# EAGLE board r3eflow-v3 (EAGLE 9.3.2)
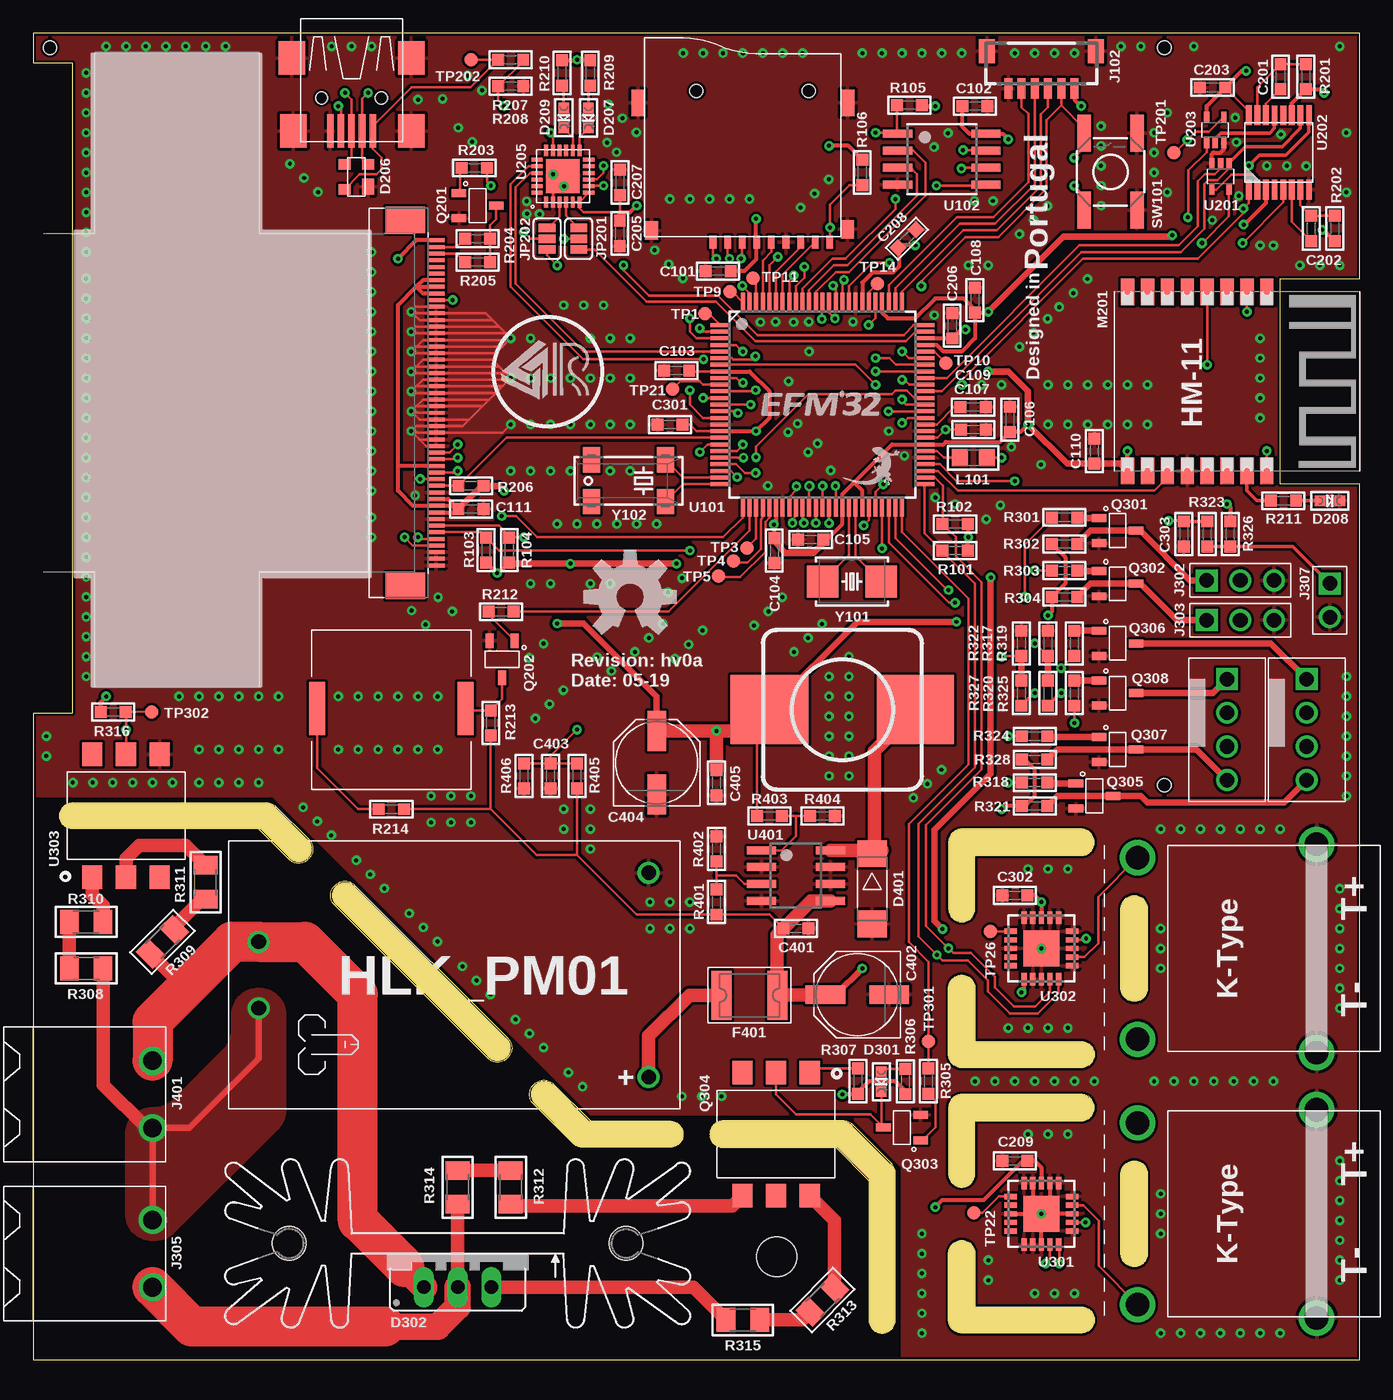
[diagram p4: board, top side]
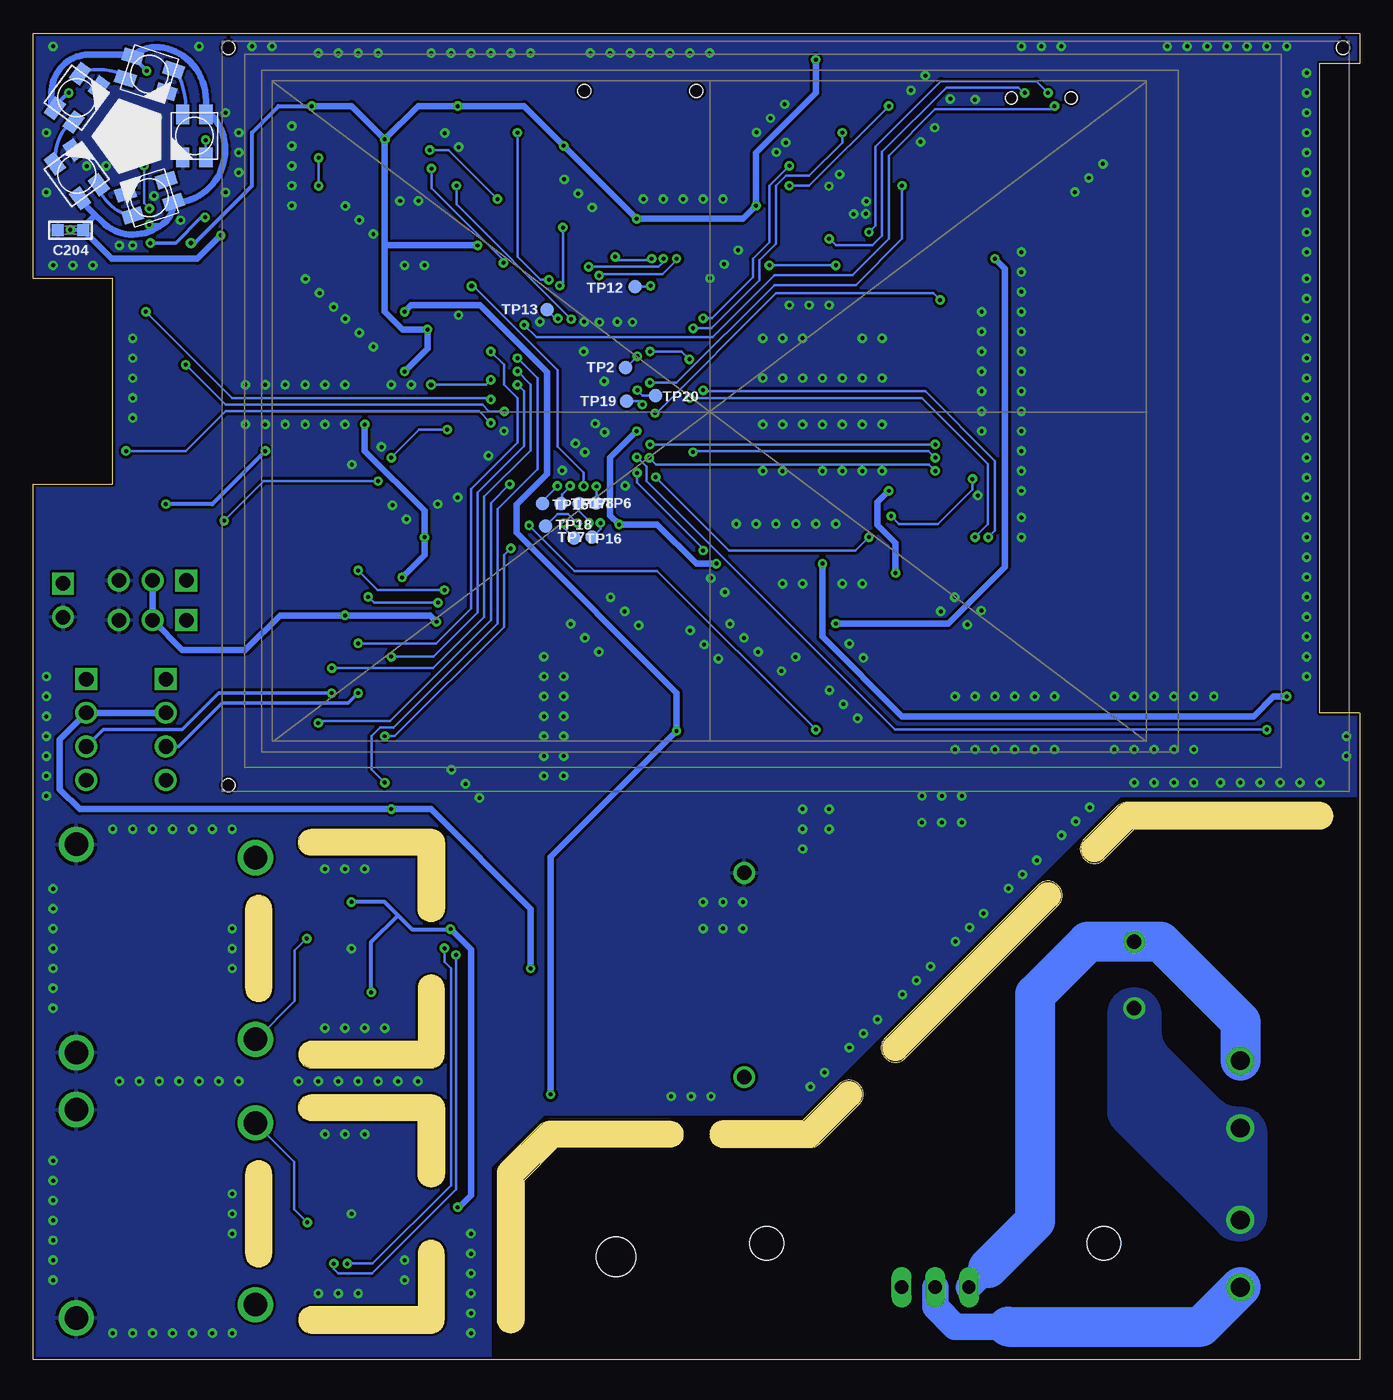
[diagram p5: board, bottom side, seen from below]

Size 100 x 100 mm. Coordinates in mm from the lower left corner, seen from the top.
Outline: 0,0 100,0 100,66 94,66 94,81.5 100,81.5 100,100 0,100 0,97.75 3,97.75 3,48.75 0,48.75 0,0
Outline: 69,23 69,28 arc-90 70,29 arc-90 71,28 71,24 79,24 arc-90 80,23 arc-90 79,22 70,22 arc-90 69,23
Outline: 71,18 79,18 arc90 80,19 arc90 79,20 70,20 arc90 69,19 69,14 arc90 70,13 arc90 71,14 71,18
Outline: 71,4 79,4 arc-90 80,3 arc-90 79,2 70,2 arc-90 69,3 69,8 arc-90 70,9 arc-90 71,8 71,4
Outline: 84,14 84,8 arc-90 83,7 arc-90 82,8 82,14 arc-90 83,15 arc-90 84,14
Outline: 82,28 82,34 arc-90 83,35 arc-90 84,34 84,28 arc-90 83,27 arc-90 82,28
Outline: 79,40 70,40 arc90 69,39 69,34 arc90 70,33 arc90 71,34 71,38 79,38 arc90 80,39 arc90 79,40
Outline: 2,41 arc-90 3,42 17.59,42 arc-45 18.29,41.71 20.79,39.21 arc-90 20.79,37.79 20.71,37.71 arc-90 19.29,37.71 17,40 3,40 arc-90 2,41
Outline: 42,18 48,18 arc-90 49,17 arc-90 48,16 41.41,16 arc-45 40.71,16.29 37.71,19.29 arc-90 37.71,20.71 37.79,20.79 arc-90 39.21,20.79 42,18
Outline: 35.79,22.79 35.71,22.71 arc-90 34.29,22.71 22.71,34.29 arc-90 22.71,35.71 22.79,35.79 arc-90 24.21,35.79 35.79,24.21 arc-90 35.79,22.79
Outline: 61.09,18 52,18 arc90 51,17 arc90 52,16 60.5,16 63,13.5 63,3 arc90 64,2 arc90 65,3 65,14.09 arc45 64.71,14.79 61.79,17.71 arc45 61.09,18
Copper layers (1*16): Top 0.035mm / dielectric 1.5mm / Bottom 0.035mm
Design rules "default *": minimum track width 5mil, minimum drill 0.3mm, track to track 5mil, track to pad 5mil, pad to pad 5mil, via to via 5mil, smd to smd 5mil, copper to edge 0.2mm, drill to drill 5mil, minimum pad ring 10mil, minimum via ring 8mil, stop-mask expansion 4mil, vias tented up to drill 0.7mm, thermal gap 10mil
Holes 3 mm at 56.05,7.75
tRestrict: area 53.1,4.7 to 59.1,10.7
bRestrict: area 53.1,4.7 to 59.1,10.7
Milling: 18 lines

## Footprints (pad centres in the part's own frame; a part is rotated, then mirrored left to right if it is on the bottom)
HLK-PM01 = drill 1.1: +VO 29.4,-7.7; -VO 29.4,7.7; AC1 0,2.5; AC2 0,-2.5
BUZZ_PIEZO_SMD = smd 1.2 x 4: 1 -5.6,0.1; 2 5.6,0.1
0603_WAVE = smd 0.9 x 0.9: P$1 -0.95,0; P$2 0.95,0
PANASONIC_D = smd 3 x 1.4: + 2.4,0; - -2.4,0
3535 = smd 1 x 1.5: 1 -0.875,-1.619; 2 0.875,-1.619; 3 0.875,1.619; 4 -0.875,1.619
SOT143 = smd 1.2 x 0.9: 1 -0.711,-0.889 | smd 0.8 x 0.9: 2 0.989,-0.889; 3 0.989,0.911; 4 -0.911,0.911
CHIPLED_0603 = smd 0.8 x 0.8: A 0,-0.75; C 0,0.75
TO220DS = drill 1.016 long: A1 -2.54,-2.54; A2 0,-2.54; G 2.54,-2.54
DO214AA = smd 2 x 2.2: A 2.65,0; C -2.65,0
PTC1812 = smd 1.5 x 3.7: P$1 -2.1,0; P$2 2.1,0
MICRO-SD = smd 0.5 x 1: 1 2.25,6.75; 2 1.15,6.75; 3 0.05,6.75; 4 -1.05,6.75; 5 -2.15,6.75; 6 -3.25,6.75; 7 -4.35,6.75; 8 -5.45,6.75; 9 -6.55,6.75 | smd 1 x 1.4: BODY1 -7.89,5.78; BODY4 6.89,5.88 | smd 1 x 2: BODY2 -7.9,-3.75; BODY3 7.9,-3.75 | hole 1: -4.95,-4.65; 3.5,-4.65
SM06B-SSR-H-TB = smd 0.6 x 1.55: 1 -2.5,1.925; 2 -1.5,1.925; 3 -0.5,1.925; 4 0.5,1.925; 5 1.5,1.925; 6 2.5,1.925 | smd 1.2 x 1.8: FIT@1 -4.1,-0.9; FIT@2 4.1,-0.9
USB-M-S1 = smd 2.5 x 0.5: D+ 2.75,0; D- 2.75,0.8; GND 2.75,-1.6; ID 2.75,-0.8; VBUS 2.75,1.6 | smd 2.5 x 2: GND@1 -2.75,-4.5; GND@2 -2.75,4.5; GND@3 2.75,-4.4; GND@4 2.75,4.5 | hole 0.9: 0.25,2.25; 0.25,-2.25
PCC-SMP = drill 1.77: 1-T+ -6.85,-6.75; 2-T- 6.85,-6.75; 3-BAR 7.85,6.75; 4-BAR -7.85,6.75
3X1_2.54 = drill 1.1 square: P$1 -2.54,0 | drill 1.1: P$2 0,0; P$3 2.54,0
2EDG-2P = drill 1.4: P$1 -2.54,0; P$2 2.54,0
KF2510-3+1P = drill 1.1 square: 1 -3.81,0 | drill 1.1: 2 -1.27,0; 3 1.27,0; 4 3.81,0
2X1_2.54 = drill 1.1 square: 1 -1.27,0 | drill 1.1: 2 1.27,0
SMT-JUMPER_3_1-NC_PASTE_SILK = smd 0.635 x 1.27: 1 -0.813,0; 2 0,0; 3 0.813,0
SK104 = hole 2.54: -12.7,-0.762; 12.7,-0.762
_0805 = smd 1.2 x 1.3: 1 -1.016,0; 2 1.016,0
1207 = smd 5.8 x 5.2: 1 -5.5,0 | smd 5.9 x 5.2: 2 5.5,0
HM-11 = smd 2 x 1: 1 0,10.5; 2 0,9; 3 0,7.5; 4 0,6; 5 0,4.5; 6 0,3; 7 0,1.5; 8 0,0; 9 13.5,0; 10 13.5,1.5; 11 13.5,3; 12 13.5,4.5; 13 13.5,6; 14 13.5,7.5; 15 13.5,9; 16 13.5,10.5
SOT-23-3 = smd 0.6 x 1.1: P$1 -0.95,-1.4; P$2 0.95,-1.4; P$3 0,1.4
DIP-6-SMD = smd 1.52 x 1.78: P$1 -2.54,-4.635; P$2 0,-4.635; P$3 2.54,-4.635; P$4 2.54,4.635; P$5 0,4.635; P$6 -2.54,4.635
_1206 = smd 1.4 x 1.8: 1 -1.27,0; 2 1.27,0
PUSH_BUTTON = smd 2.8 x 1: 1 -2.9,2; 2 2.9,2; 3 -2.9,-2; 4 2.9,-2
TEST_POINT = smd 1 x 1: 1 0,0
QFP100 = smd 1.45 x 0.3: 1 -7.7,6; 2 -7.7,5.5; 3 -7.7,5; 4 -7.7,4.5; 5 -7.7,4; 6 -7.7,3.5; 7 -7.7,3; 8 -7.7,2.5; 9 -7.7,2; 10 -7.7,1.5; 11 -7.7,1; 12 -7.7,0.5; 13 -7.7,0; 14 -7.7,-0.5; 15 -7.7,-1; 16 -7.7,-1.5; 17 -7.7,-2; 18 -7.7,-2.5; 19 -7.7,-3; 20 -7.7,-3.5; 21 -7.7,-4; 22 -7.7,-4.5; 23 -7.7,-5; 24 -7.7,-5.5; 25 -7.7,-6; 51 7.7,-6; 52 7.7,-5.5; 53 7.7,-5; 54 7.7,-4.5; 55 7.7,-4; 56 7.7,-3.5; 57 7.7,-3; 58 7.7,-2.5; 59 7.7,-2; 60 7.7,-1.5; 61 7.7,-1; 62 7.7,-0.5; 63 7.7,0; 64 7.7,0.5; 65 7.7,1; 66 7.7,1.5; 67 7.7,2; 68 7.7,2.5; 69 7.7,3; 70 7.7,3.5; 71 7.7,4; 72 7.7,4.5; 73 7.7,5; 74 7.7,5.5; 75 7.7,6 | smd 0.3 x 1.45: 26 -6,-7.7; 27 -5.5,-7.7; 28 -5,-7.7; 29 -4.5,-7.7; 30 -4,-7.7; 31 -3.5,-7.7; 32 -3,-7.7; 33 -2.5,-7.7; 34 -2,-7.7; 35 -1.5,-7.7; 36 -1,-7.7; 37 -0.5,-7.7; 38 0,-7.7; 39 0.5,-7.7; 40 1,-7.7; 41 1.5,-7.7; 42 2,-7.7; 43 2.5,-7.7; 44 3,-7.7; 45 3.5,-7.7; 46 4,-7.7; 47 4.5,-7.7; 48 5,-7.7; 49 5.5,-7.7; 50 6,-7.7; 76 6,7.7; 77 5.5,7.7; 78 5,7.7; 79 4.5,7.7; 80 4,7.7; 81 3.5,7.7; 82 3,7.7; 83 2.5,7.7; 84 2,7.7; 85 1.5,7.7; 86 1,7.7; 87 0.5,7.7; 88 0,7.7; 89 -0.5,7.7; 90 -1,7.7; 91 -1.5,7.7; 92 -2,7.7; 93 -2.5,7.7; 94 -3,7.7; 95 -3.5,7.7; 96 -4,7.7; 97 -4.5,7.7; 98 -5,7.7; 99 -5.5,7.7; 100 -6,7.7
WSOIC8 = smd 0.6 x 2.2: 1 -1.905,-3.33; 2 -0.635,-3.33; 3 0.635,-3.33; 4 1.905,-3.33; 5 1.905,3.33; 6 0.635,3.33; 7 -0.635,3.33; 8 -1.905,3.33
SC-70-5 = smd 0.4 x 0.75: 1 -0.65,-1; 2 0,-1; 3 0.65,-1; 4 0.65,1; 5 -0.65,1
TSSOP-16 = smd 0.45 x 1.5: 1 -2.275,-2.8; 2 -1.625,-2.8; 3 -0.975,-2.8; 4 -0.325,-2.8; 5 0.325,-2.8; 6 0.975,-2.8; 7 1.625,-2.8; 8 2.275,-2.8; 9 2.275,2.8; 10 1.625,2.8; 11 0.975,2.8; 12 0.325,2.796; 13 -0.325,2.796; 14 -0.975,2.8; 15 -1.625,2.8; 16 -2.275,2.8
ZIF50-TFT_BACK = smd 1.3 x 0.3 bottom: 1 55.369,41.54; 2 55.369,41.04; 3 55.369,40.54; 4 55.369,40.04; 5 55.369,39.54; 6 55.369,39.04; 7 55.369,38.54; 8 55.369,38.04; 9 55.369,37.54; 10 55.369,37.04; 11 55.369,36.54; 12 55.369,36.04; 13 55.369,35.54; 14 55.369,35.04; 15 55.369,34.54; 16 55.369,34.04; 17 55.369,33.54; 18 55.369,33.04; 19 55.369,32.54; 20 55.369,32.04; 21 55.369,31.54; 22 55.369,31.04; 23 55.369,30.54; 24 55.369,30.04; 25 55.369,29.54; 26 55.369,29.04; 27 55.369,28.54; 28 55.369,28.04; 29 55.369,27.54; 30 55.369,27.04; 31 55.369,26.54; 32 55.369,26.04; 33 55.369,25.54; 34 55.369,25.04; 35 55.369,24.54; 36 55.369,24.04; 37 55.369,23.54; 38 55.369,23.04; 39 55.369,22.54; 40 55.369,22.04; 41 55.369,21.54; 42 55.369,21.04; 43 55.369,20.54; 44 55.369,20.04; 45 55.369,19.54; 46 55.369,19.04; 47 55.369,18.54; 48 55.369,18.04; 49 55.369,17.54; 50 55.369,17.04 | smd 3 x 2 bottom: M1 57.694,15.5; M2 57.694,43.08 | hole 1: 0.475,56.065; 0.475,0.475; 84.485,56.065
QFN24 = smd 0.3 x 0.85: 1 -1.25,-1.95; 2 -0.75,-1.95; 3 -0.25,-1.95; 4 0.25,-1.95; 5 0.75,-1.95; 6 1.25,-1.95; 13 1.25,1.95; 14 0.75,1.95; 15 0.25,1.95; 16 -0.25,1.95; 17 -0.75,1.95; 18 -1.25,1.95 | smd 0.85 x 0.3: 7 1.95,-1.25; 8 1.95,-0.75; 9 1.95,-0.25; 10 1.95,0.25; 11 1.95,0.75; 12 1.95,1.25; 19 -1.95,1.25; 20 -1.95,0.75; 21 -1.95,0.25; 22 -1.95,-0.25; 23 -1.95,-0.75; 24 -1.95,-1.25 | smd 2.55 x 2.55: PAD 0,0
TQFN20-5X5 = smd 0.95 x 0.4: 1 -2.325,1.3; 2 -2.325,0.65; 3 -2.325,0; 4 -2.325,-0.65; 5 -2.325,-1.3; 11 2.325,-1.3; 12 2.325,-0.65; 13 2.325,0; 14 2.325,0.65; 15 2.325,1.3 | smd 0.4 x 0.95: 6 -1.3,-2.325; 7 -0.65,-2.325; 8 0,-2.325; 9 0.65,-2.325; 10 1.3,-2.325; 16 1.3,2.325; 17 0.65,2.325; 18 0,2.325; 19 -0.65,2.325; 20 -1.3,2.325 | smd 2.7 x 2.7: EXP 0,0
SOIC8 = smd 0.6 x 2.2: 1 -1.905,-2.6; 2 -0.635,-2.6; 3 0.635,-2.6; 4 1.905,-2.6; 5 1.905,2.6; 6 0.635,2.6; 7 -0.635,2.6; 8 -1.905,2.6
2-SMD-5X3 = smd 2.4 x 2.4: 1 -2.2,0; 2 2.2,0
CM200S = smd 1.3 x 1.9: 1 -2.794,-1.574; 2 2.794,-1.574; 3 2.794,1.574; 4 -2.794,1.574

## Placement (x,y rotation side)
ACDC401  HLK-PM01  [HLK-PM01]  17,29 0 top
B201  [BUZZ_PIEZO_SMD]  27,49 0 top
C101  100n  [0603_WAVE]  51.64,82.07 180 top
C102  100n  [0603_WAVE]  71,94.5 0 top
C103  100n  [0603_WAVE]  48.51,74.57 180 top
C104  100n  [0603_WAVE]  55.87,60.99 270 top
C105  100n  [0603_WAVE]  58.61,61.82 180 top
C106  1u  [0603_WAVE]  73.63,70.88 90 top
C107  4u7  [0603_WAVE]  70.87,70.11 0 top
C108  1u  [0603_WAVE]  71,79.88 90 top
C109  1u  [0603_WAVE]  70.86,71.8 0 top
C110  100n  [0603_WAVE]  80,68.5 90 top
C111  100n  [0603_WAVE]  33,64.12 0 top
C201  100p  [0603_WAVE]  94.03,96.72 90 top
C202  100p  [0603_WAVE]  96.34,85.28 90 top
C203  [0603_WAVE]  88.91,95.91 180 top
C204  [0603_WAVE]  97.19,85.14 180 bottom
C205  [0603_WAVE]  44.22,84.9 270 top
C206  [0603_WAVE]  69.28,77.94 90 top
C207  [0603_WAVE]  44.25,88.75 90 top
C208  [0603_WAVE]  65.88,84.5 45 top
C209  [0603_WAVE]  74,15 180 top
C301  [0603_WAVE]  48,70.5 180 top
C302  [0603_WAVE]  74,35 180 top
C303  [0603_WAVE]  86.75,62.25 270 top
C401  100n  [0603_WAVE]  57.5,32.5 0 top
C402  [PANASONIC_D]  62.12,27.52 180 top
C403  [0603_WAVE]  39,44 270 top
C404  100u  [PANASONIC_D]  47,45 90 top
C405  100n  [0603_WAVE]  51.5,43.5 270 top
D201  WS2812B  [3535]  87.85,92.25 0 bottom
D202  WS2812B  [3535]  91.23,96.91 72 bottom
D203  WS2812B  [3535]  96.71,95.13 144 bottom
D204  WS2812B  [3535]  96.71,89.37 216 bottom
D205  WS2812B  [3535]  91.23,87.59 288 bottom
D206  SP0503BAHT  [SOT143]  24.38,89.12 90 top
D207  LED0603  [CHIPLED_0603]  41.86,93.61 180 top
D208  LED0603  [CHIPLED_0603]  97.75,64.75 270 top
D209  LED0603  [CHIPLED_0603]  40,93.62 180 top
D301  LED0603  [CHIPLED_0603]  63.94,20.96 180 top
D302  BTA16  [TO220DS]  32,8 0 top
D401  SK54L  [DO214AA]  63.25,35.5 270 top
F401  1A  [PTC1812]  54,27.48 180 top
J101  MICROSD  [MICRO-SD]  53.5,91 180 top
J102  SH-6  [SM06B-SSR-H-TB]  76,97.75 180 top
J201  USB-SHIELD  [USB-M-S1]  24,95.38 270 top
J301  PCC-SMP  [PCC-SMP]  90,11 270 top
J302  3X1_2.54  [3X1_2.54]  91,58.75 0 top
J303  3X1_2.54  [3X1_2.54]  91,55.75 0 top
J304  PCC-SMP  [PCC-SMP]  90,31 270 top
J305  2EDG-2P  [2EDG-2P]  9,8 270 top
J306  4P-PC-FAN  [KF2510-3+1P]  96,47.5 270 top
J307  2X1_2.54  [2X1_2.54]  97.75,57.25 270 top
J308  4P-PC-FAN  [KF2510-3+1P]  90,47.5 270 top
J401  2EDG-2P  [2EDG-2P]  9,20 270 top
JP201  JUMPER-SMT_3_1-NC_PASTE_SILK  [SMT-JUMPER_3_1-NC_PASTE_SILK]  41.13,84.5 90 top
JP202  JUMPER-SMT_3_1-NC_PASTE_SILK  [SMT-JUMPER_3_1-NC_PASTE_SILK]  38.75,84.5 90 top
KK301  SK104  [SK104]  32,8 180 top
L101  4.7nH  [_0805]  70.87,68 180 top
L401  68uH  [1207]  61,49 180 top
LOGO101  DESIGNEDINPT  [DESIGNEDINPT]  76.5,81.5 90 top
LOGO102  RAFAEL_SILVA  [RAFAEL_SILVA_5MM_ALT_3]  36.05,74.38 0 top
LOGO103  OSHW-LOGOL  [OSHW-LOGO-L]  45,57.5 0 top
M201  HM-11  [HM-11]  82.5,80.5 270 top
Q201  BC817-40  [SOT-23-3]  33.5,87 270 top
Q202  BC817-40  [SOT-23-3]  35.35,52.81 180 top
Q301  BC817-40  [SOT-23-3]  81.75,62.5 270 top
Q302  BC817-40  [SOT-23-3]  81.75,58.5 270 top
Q303  BC817-40  [SOT-23-3]  65.5,17.5 90 top
Q304  MOC3051  [DIP-6-SMD]  56,17 180 top
Q305  BC817-40  [SOT-23-3]  80,42.5 270 top
Q306  BC817-40  [SOT-23-3]  81.75,54 270 top
Q307  BC817-40  [SOT-23-3]  81.75,46 270 top
Q308  BC817-40  [SOT-23-3]  81.75,50.25 270 top
R101  [0603_WAVE]  69.5,61 0 top
R102  [0603_WAVE]  69.5,63 0 top
R103  [0603_WAVE]  34.14,61.03 270 top
R104  [0603_WAVE]  35.89,61.03 270 top
R105  [0603_WAVE]  66.05,94.56 0 top
R106  [0603_WAVE]  62.5,89.5 90 top
R201  3k95  [0603_WAVE]  95.94,96.72 90 top
R202  3k95  [0603_WAVE]  98.12,85.28 90 top
R203  [0603_WAVE]  33.26,89.84 180 top
R204  [0603_WAVE]  33.5,84.5 180 top
R205  [0603_WAVE]  33.5,82.75 180 top
R206  [0603_WAVE]  33,65.88 0 top
R207  22.1k  [0603_WAVE]  36,98 180 top
R208  47.5k  [0603_WAVE]  36,96 180 top
R209  [0603_WAVE]  42,97 270 top
R210  [0603_WAVE]  39.88,97 270 top
R211  [0603_WAVE]  94.25,64.75 0 top
R212  [0603_WAVE]  35.27,56.38 180 top
R213  [0603_WAVE]  34.5,48 270 top
R214  [0603_WAVE]  27,41.5 0 top
R301  [0603_WAVE]  77.75,63.5 0 top
R302  [0603_WAVE]  77.75,61.5 180 top
R303  [0603_WAVE]  77.75,59.5 0 top
R304  [0603_WAVE]  77.75,57.5 180 top
R305  [0603_WAVE]  67.5,21 270 top
R306  [0603_WAVE]  65.74,20.97 90 top
R307  [0603_WAVE]  62.16,21 270 top
R308  54.9k  [_1206]  4,29.5 180 top
R309  54.9k  [_1206]  9.75,31.5 45 top
R310  54.9k  [_1206]  4,33 0 top
R311  54.9k  [_1206]  13,36 90 top
R312  [_1206]  36,13 90 top
R313  [_1206]  59.5,4.5 225 top
R314  [_1206]  32,13 270 top
R315  [_1206]  53.5,3 180 top
R316  10k  [0603_WAVE]  6.03,48.82 180 top
R317  [0603_WAVE]  76.5,54 270 top
R318  [0603_WAVE]  75.5,43.5 0 top
R319  [0603_WAVE]  78.5,54 90 top
R320  [0603_WAVE]  76.5,50.25 270 top
R321  [0603_WAVE]  75.5,41.75 180 top
R322  [0603_WAVE]  74.5,54 270 top
R323  [0603_WAVE]  88.5,62.25 90 top
R324  [0603_WAVE]  75.5,47 0 top
R325  [0603_WAVE]  78.5,50.25 90 top
R326  [0603_WAVE]  90.25,62.25 90 top
R327  [0603_WAVE]  74.5,50.25 270 top
R328  [0603_WAVE]  75.5,45.25 180 top
R401  10M  [0603_WAVE]  51.5,34.5 270 top
R402  10k  [0603_WAVE]  51.5,38.5 270 top
R403  3.01k  [0603_WAVE]  55.5,41 180 top
R404  1k  [0603_WAVE]  59.5,41 180 top
R405  [0603_WAVE]  41,44 270 top
R406  [0603_WAVE]  37,44 90 top
SW101  [PUSH_BUTTON]  81.22,89.55 90 top
TP1  TEST_POINT  [TEST_POINT]  50.65,78.87 0 top
TP2  TEST_POINT  [TEST_POINT]  55.33,74.78 0 bottom
TP3  TEST_POINT  [TEST_POINT]  53.81,61.2 90 top
TP4  TEST_POINT  [TEST_POINT]  52.79,60.19 0 top
TP5  TEST_POINT  [TEST_POINT]  51.67,59.07 0 top
TP6  TEST_POINT  [TEST_POINT]  57.55,64.56 0 bottom
TP7  TEST_POINT  [TEST_POINT]  57.86,62.01 0 bottom
TP8  TEST_POINT  [TEST_POINT]  58.87,64.55 0 bottom
TP9  TEST_POINT  [TEST_POINT]  52.52,80.52 0 top
TP10  TEST_POINT  [TEST_POINT]  68.81,75.11 0 top
TP11  TEST_POINT  [TEST_POINT]  54.26,81.55 0 top
TP12  TEST_POINT  [TEST_POINT]  54.65,80.89 0 bottom
TP13  TEST_POINT  [TEST_POINT]  61.28,79.16 0 bottom
TP14  TEST_POINT  [TEST_POINT]  63.65,81.13 0 top
TP15  TEST_POINT  [TEST_POINT]  61.6,64.53 270 bottom
TP16  TEST_POINT  [TEST_POINT]  59.21,61.95 270 bottom
TP17  TEST_POINT  [TEST_POINT]  60.19,64.54 270 bottom
TP18  TEST_POINT  [TEST_POINT]  61.36,62.84 270 bottom
TP19  TEST_POINT  [TEST_POINT]  55.26,72.25 180 bottom
TP20  TEST_POINT  [TEST_POINT]  53.08,72.68 180 bottom
TP21  TEST_POINT  [TEST_POINT]  48.19,73.15 180 top
TP22  TEST_POINT  [TEST_POINT]  70.93,11.06 0 top
TP26  TEST_POINT  [TEST_POINT]  72.14,32.29 90 top
TP201  TEST_POINT  [TEST_POINT]  86,91 90 top
TP202  TEST_POINT  [TEST_POINT]  33,98 90 top
TP301  TEST_POINT  [TEST_POINT]  67.5,24 0 top
TP302  TEST_POINT  [TEST_POINT]  8.95,48.82 270 top
U101  EFM32GG11B8XX_Q100  [QFP100]  59.5,72 0 top
U102  SST26VF064B  [WSOIC8]  68.5,90.5 270 top
U201  74LVC1G08  [SC-70-5]  89.5,89.2 180 top
U202  74HC123  [TSSOP-16]  93.91,91 0 top
U203  74LVC1G32  [SC-70-5]  89.11,92.71 0 top
U204  ER-TFT035-6BOT  [ZIF50-TFT_BACK]  85.75,42.84 0 bottom
U205  CP2102N  [QFN24]  39.93,89.21 0 top
U301  MCP9600  [TQFN20-5X5]  76,11 180 top
U302  MCP9600  [TQFN20-5X5]  76,31 180 top
U303  H11AA1  [DIP-6-SMD]  7,41 0 top
U401  MIC4682  [SOIC8]  57.5,36.5 270 top
Y101  8MHz  [2-SMD-5X3]  61.72,58.67 180 top
Y102  32.768KHz  [CM200S]  44.88,66.25 180 top

## Tracks (layer width: path | path; a pad name or v marks a point on that pad's centre or on a via)
2.8V  (via drill 0.3 pad 0.6, 0.35 pad 0.6)
  Top 0.203: J101.4 54.5,84.2 | C206.P$1 | 61,64 U101.41 | C301.P$1 49.5,70.5 50,70 U101.17 | U205.7 U205.6 | U205.6 U205.5 | C205.P$1 44.25,85.88 44.25,86.5 | 44.25,86.5 C207.P$1 | U205.6 41.18,86.82 41.5,86.5 44.25,86.5 | U101.8 49.53,74.5 C103.P$1 | U201.5 90.15,86.2 88.13,84.18 v88.11,84.18 | 59.74,62 C105.P$1 59.56,61.56
  Top 0.305: C101.P$1 53.64,82.07 54.5,82.93 54.5,84.2 | U101.73 C206.P$1 | U101.82 62.5,81.2 63.25,81.95 64.82,81.95 65.28,82.41 65.28,83.76 C208.P$1 65.37,84 v66.5,84 | C206.P$1 69.95,77.66 v70.28,77.66 | v73.5,92 73.09,92.41 U102.8 70.59,92.41 70,93 70.05,93.05 C102.P$1 | J102.1 78.5,95 v79,94.5 | R209.P$1 41.95,98 v41,98 40.95,97.95 R210.P$1 | C205.P$1 44.22,86.39 44.29,86.47 44.97,86.47 v45.5,87 | J101.4 54.5,84.3 v54.5,86 | R105.P$2 67.06,94.5 v68,94.5 | v75,70.5 74.43,69.93 C106.P$1 72.87,69.18 68.8,69.18 68.62,69 U101.57 64.75,69 61.88,66.12 | M201.9 v82.5,68.5 | v90,64.5 90.25,64.25 R326.P$2 | R102.P$2 70.5,62.95 v70.5,62 70.45,61.95 R101.P$2 | U101.8 54,74.5 55.5,73 55.5,71 v54.5,70 U101.17 | R103.P$2 34.93,59.3 v34.98,59.3 35.1,59.3 R104.P$2 35.98,60 | 33.8,65.88 R206.P$2 | U204.40 31.3,64.88 C111.P$1 | C111.P$1 31.8,64.38 U204.41 28.62,64.38 27.5,65.5 27.5,67.34 | U204.42 31.8,63.88 C111.P$1 | C104.P$1 55.83,61.98 v55.83,62.97 56,63.13 U101.31 | U101.41 61,65.25 61.88,66.12 | U101.44 62.5,65.5 61.88,66.12 | 61,64 61,63 59.82,61.82 C105.P$1 | U204.7 29.38,81.38 28.88,80.88 | 27.5,67.34 27.5,79.5 28.88,80.88 | U204.35 27.54,67.38 27.5,67.34 | 28.88,80.88 U204.8 | 28.88,80.88 29.38,80.38 U204.9 | R316.P$2 5.08,49.58 v5.5,50 | U302.8 v76,34.5 75.5,35 C302.P$1 | U302.16 74.7,27.9 v74.51,27.7 | R106.P$2 61.45,91.5 v60,91.5 | v68,11.5 68.52,12.02 71.64,12.02 74.62,15 C209.P$1 75.5,15 76,14.5 U301.8
  Top 0.508: v72,74.5 73.5,74.5 75,73 v75,70.5 77.95,67.55 C110.P$1 81.95,67.55 M201.9 | C104.P$1 55.87,61.68 56.72,60.82 58.82,60.82 59.56,61.56 | 35.98,60 v40.5,60 v48.5,60 | C111.P$1 33.8,65.88 | v72.19,58.98 72.17,58.96 72.17,44.16 67.93,39.93 67.93,33.09 v68.55,32.47 | R206.P$2 35.12,65.88 v35.5,65.5
  Bottom 0.305: v82.5,68.5 86.5,64.5 v90,64.5 | 72.5,33.5 71.45,32.45 68.57,32.45 v68.55,32.47 68.52,32.47 | 72.5,33.5 73.5,34.5 v76,34.5 | v74.51,27.7 74.51,31.49 72.5,33.5 | v88.11,84.18 87.82,84.18 83.5,88.5 83.5,92.5 81.5,94.5 v79,94.5
  Bottom 0.508: 73.5,84 73.5,79 72.16,77.66 v70.28,77.66 70.28,76.22 v72,74.5 | 73.5,84 v73.5,92 | v79,94.5 76,94.5 v73.5,92 | 73.5,84 v66.5,84 | v73.5,92 71,94.5 v68,94.5 63,94.5 v60,91.5 v54.5,86 46.5,86 v45.5,87 45.5,91 41,95.5 v41,98 | v75,70.5 75,68.5 70.5,64 v70.5,62 70.5,60.67 v72.19,58.98 | v54.5,70 56.5,68 56.5,63.65 55.83,62.98 v55.83,62.97 52.97,62.97 50,60 v48.5,60 | v5.5,50 6.5,50 8,48.5 34.5,48.5 40.5,54.5 v40.5,60 | 68.52,32.47 67,30.94 67,12.4 67.91,11.5 v68,11.5 | v35.5,65.5 36.35,64.64 36.35,62.92 34.98,61.55 v34.98,59.3
5V  (via drill 0.3 pad 0.6)
  Top 0.203: C203.P$1 91.63,94.13 | R403.P$2 54.55,48.05 L401.2
  Top 0.254: 97.27,85.18 v97.19,85.18 | 91.63,94.13 U202.16
  Top 0.305: R202.P$1 97.27,85.18 | U202.11 94.88,94.71 R201.P$1 97.05,95.77 v97.32,95.49 | U203.5 88.46,94.51 C203.P$1 91.11,97.16 v91.44,97.16 | U202.3 92.93,87.2 91.31,85.58 v91.25,85.58 | C108.P$1 71,77 70,76 68.62,76 68.12,76.5 U101.72 | C108.P$1 71,79.15 70.15,80 68,80 66.5,78.5 64.43,78.5 64,78.93 U101.79 | C108.P$1 71.92,78.92 v72,79 | U204.1 28.88,84.38 v27.5,83 | v76.5,56.11 76.8,56.41 R304.P$2 77.8,58.5 77.8,60.5 R302.P$2 | R307.P$2 62.11,20 | 62.11,20 62.45,20 62.45,20.45 63,21 65,21 65.74,20.26 R306.P$1 | 62.11,20 v61,20
  Top 0.508: v39.5,55.5 41.5,55.5 47,50 C404.+ | v69.6,55.63 62.13,55.63 L401.2 | v72,79 77.66,84.66 85.77,84.66 v85.87,84.76
  Top 1.016: L401.2 53.9,47.4 v51.5,47.4 | v51.5,47.4 C404.+ | C405.P$1 v51.5,47.4
  Bottom 0.203: C204.P$1 96.27,85.18
  Bottom 0.254: 92.63,98.37 D202.3 92.5,98.22 | 98.62,94.59 D203.3 98.37,94.49 | D205.3 89.42,87.21 | 96.58,87.57 96.59,87.58 96.5,87.58 D204.3 | v97.32,95.49 97.37,95.49
  Bottom 0.305: v97.19,85.18 96.27,85.18 | 98.37,94.49 97.37,95.49 | v91.44,97.16 92.5,98.22 | v91.25,85.58 90.25,85.58 89.99,85.84
  Bottom 0.508: J302.P$2 J303.P$2 88.75,53.5 84,53.5 81.39,56.11 v76.5,56.11 70.08,56.11 v69.6,55.63 | 92.63,98.37 95.84,98.37 arc-45 97.75,97.58 arc-45 98.62,95.46 98.62,94.59 | 89.42,87.21 arc45 89.99,85.84 arc45 92.46,84.82 arc45 94.81,85.79 95.31,86.3 | 95.31,86.3 96.58,87.57 | D202.3 arc45 90.8,98.95 arc45 88.19,97.87 arc45 86.97,94.92 D201.3 86.76,93.87 arc-45 86.64,93.92 arc45 85.53,91.22 arc45 86.72,88.34 arc45 89.32,87.26 D205.3 | 95.31,86.3 96.07,85.54 arc-45 C204.P$1 94.09,83 87.63,83 v85.87,84.76 | v72,79 71.5,79.5 66.32,79.5 61.25,74.43 61.25,66.78 63.57,64.46 63.57,62.34 51.5,50.27 v51.5,47.4 61,37.9 v61,20 | v39.5,55.5 31,55.5 26.76,59.74 26.76,82.26 v27.5,83
5V-FB
  Top 0.203: R403.P$1 57.5,41 | 57.5,41 R404.P$2 | U401.1 56.41,38.41 57.5,39.5 57.5,41
12V  (via drill 0.3 pad 0.6)
  Top 0.203: C401.P$1 55.5,33.55 R401.P$2 45.5,33.55 41,38.05 | R214.P$2 27.98,41.47 28.02,41.5 34.5,41.5 | R213.P$2 34.5,41.5 | 34.5,41.5 37.95,38.05 41,38.05 | R405.P$2 41,38.05
  Top 0.305: v73,41.5 73.25,41.75 R321.P$2 74.75,41.75 75.5,42.5 75.5,44.5 74.75,45.25 R328.P$2
  Top 0.508: v62.5,29.5 60.52,27.52 C402.+
  Top 1.016: C402.+ 56.19,27.52 | F401.P$1 56.08,27.49 56.08,32.03 C401.P$1 58.65,34.59 U401.5
  Top 1.27: F401.P$1 56.14,27.52 56.19,27.52
  Bottom 0.508: J308.2 J306.2 98,46.77 98,43 96.5,41.5 v73,41.5 70,41.5 62.5,34 v62.5,29.5
12V-FB  (via drill 0.3 pad 0.6)
  Top 0.203: U101.45 63,63.29 62.61,62.91 v62.61,62.89 | R406.P$2 C403.P$1 | C403.P$1 R405.P$1 | C403.P$1 39,45.5 v41,47.5
  Bottom 0.203: v41,47.5 52.96,59.46 59.18,59.46 v62.61,62.89
!LED-CS  (via drill 0.3 pad 0.6, 0.35)
  Top 0.203: U202.1 91.63,87.17 v91.24,86.78 91.24,86.44 87.8,83 79.14,83 70,73.86 v70,73.5 | U101.66 66.06,73.5 65.68,73.87 v65.5,73.87
  Top 0.254: U202.9 96.18,92.55 94.44,90.81 92.44,90.81 v91.64,90.01
  Bottom 0.203: v91.64,90.01 91.64,87.2 91.24,86.79 | v70,73.5 65.87,73.5 v65.5,73.87
  Bottom 0.254: 91.24,86.79 v91.24,86.78
!RESET  (via drill 0.3 pad 0.6, 0.35, 0.35 pad 0.6)
  Top 0.203: J102.2 77.5,94.56 | v66.95,80.94 66.95,81.31 70.27,84.64 72.75,84.64 76.38,88.27 76.38,93.44 77.5,94.56 | v58.5,65.85 U101.36 | 77.5,94.56 79.22,92.84 SW101.2 79,92.23 79,91.12 v78.48,90.61 | SW101.1 79.22,87.76 v78.48,88.49
  Bottom 0.203: v66.95,80.94 66.78,80.94 60.45,74.61 60.45,68.83 58.5,66.88 v58.5,65.85 | v78.48,90.61 v78.48,88.49
!TFT_RESET  (via drill 0.3 pad 0.6)
  Top 0.203: v53.12,71.35 52.98,71.49 U101.14 | v31.63,79.88 U204.10
  Bottom 0.203: v53.12,71.35 53.02,71.35 43.99,80.38 32.13,80.38 v31.63,79.88
!TTFT-IRQ  (via drill 0.3 pad 0.6)
  Top 0.203: U204.46 29.12,61.88 v29,62 | v50.5,72.5 U101.12
  Bottom 0.203: v29,62 28.02,62.98 28.02,67.52 33,72.5 v50.5,72.5
!TTFT-RST  (via drill 0.3 pad 0.6)
  Top 0.203: U204.47 28.62,61.38 v28,62 | v49.5,73.08 49.5,72 50.5,71 U101.15
  Bottom 0.203: v28,62 27.5,62.5 27.5,67.75 32.75,73 49.42,73 v49.5,73.08
AC-L
  Top 0.508: ACDC401.AC2 17,22.71 11.74,17.46 J401.P$2 J305.P$1
  Top 1: J401.P$2 8.54,17.46 5.27,20.73 R308.1
  pour Top (no thermals): 7,11 7,17 arc-90 9,19 9.17,19 arc45 10.59,19.59 14.41,23.41 arc45 15,24.83 15,26 arc-90 17,28 arc-90 19,26 19,18.83 arc-45 18.41,17.41 10.59,9.59 arc-45 9.17,9 9,9 arc-90
  pour Bottom (no thermals): 7,11 7,17 arc-90 9,19 9.17,19 arc45 10.59,19.59 14.41,23.41 arc45 15,24.83 15,26 arc-90 17,28 arc-90 19,26 19,18.83 arc-45 18.41,17.41 10.59,9.59 arc-45 9.17,9 9,9 arc-90
AC-N
  Top 1: R309.1 11,28.45 11,27.5
  Top 2: D302.A1 28,6.92 28,7
  Top 3: J401.P$1 9,25.5 11,27.5 15,31.5 ACDC401.AC1 20.5,31.5 24.46,27.54 24.46,10.46 24.54,10.46 28,7
  Bottom 2: 28,6.92 D302.A1
  Bottom 3: J401.P$1 9,25.5 15,31.5 20.5,31.5 24.46,27.54 24.46,10.46 28,6.92
BLE-!RST
  Top 0.203: U101.53 68.2,67 69.7,65.5 84.5,65.5 85.5,66.5 M201.11
BLE-KEY  (via drill 0.3 pad 0.6)
  Top 0.203: U101.61 65.93,71 65.55,70.62 v65.5,70.62 | v93,68.5 M201.16
  Bottom 0.203: v65.5,70.62 66.38,71.5 85.5,71.5 88.5,68.5 v93,68.5
D8-DI  (via drill 0.3 pad 0.6)
  Top 0.152: TP201.1 86.05,91 v87,91.95
  Top 0.203: U203.4 88.63,92.58 87.63,92.58 v87,91.95
  Bottom 0.203: v87,91.95 87,90.66
  Bottom 0.254: D201.2 87,90.66
D8_DO
  Bottom 0.254: 88.49,94.4 arc-28 89.21,97.15
  Bottom 0.508: D202.2 89.3,97.24 89.21,97.15 | D201.4 88.72,94.17 88.49,94.4
D9-DO
  Bottom 0.254: 93.45,96.97 arc-30 96.26,97.16
  Bottom 0.508: 93.45,96.97 93.43,96.96 D202.4 | 96.26,97.16 D203.2
D10-DO
  Bottom 0.254: 97.14,93.31 97.56,92.89 arc-36 98.37,90.36
  Bottom 0.508: D203.4 97.14,93.31 | 98.37,90.36 D204.2
D11-DO
  Bottom 0.254: 95.05,88.14 94.62,87.54 arc-33 93.16,86.4 92.81,86.26
  Bottom 0.508: D204.4 95.05,88.14 | 92.81,86.26 D205.2
DECOUPLE
  Top 0.203: U101.60 68.12,70.5 69.42,71.8 C109.P$1
DOOR-SW  (via drill 0.3 pad 0.6)
  Top 0.203: v74,66.24 69.61,66.24 68.34,67.5 U101.54 | v85.6,63.25 86.7,63.25 C303.P$1
  Top 0.254: R323.P$2 C303.P$1
  Bottom 0.203: v85.6,63.25 82.61,66.24 v74,66.24
DVDD  (via drill 0.3 pad 0.6)
  Top 0.203: U101.58 68.17,69.5 v68.78,70.11 C107.P$1 | L101.1 v73,68
  Bottom 0.203: v73,68 70.89,70.11 v68.78,70.11
GND  (via drill 0.3 pad 0.6)
  Top 0.203: U205.PAD 39.18,88.46 U205.2 | v28.5,79 29.12,78.38 U204.13 34.62,78.38 v36,77 | v28.5,79 28.62,78.88 U204.12 34.12,78.88 v36,77 | U204.11 28.88,79.38 v28.5,79 | v28.5,76 29.38,76.88 U204.16 35.88,76.88 v36,77 | v28.5,76 28.88,76.38 U204.17 35.38,76.38 v36,77 | v28.5,76 28.62,75.88 U204.18 34.88,75.88 v36,77 | v28.5,74.5 29.38,75.38 U204.19 34.62,75.38 v36,74 | v28.5,74.5 28.88,74.88 U204.20 35.12,74.88 v36,74 | v28.5,74.5 28.62,74.38 U204.21 35.62,74.38 v36,74 | v28.5,73 29.38,73.88 U204.22 35.88,73.88 | v28.5,73 28.88,73.38 U204.23 35.38,73.38 | v28.5,73 28.62,72.88 U204.24 34.88,72.88 | v28.5,71.5 29.38,72.38 U204.25 34.38,72.38 | v28.5,71.5 28.88,71.88 U204.26 33.88,71.88 | U204.27 28.62,71.38 v28.5,71.5 | v28.5,71.5 29.12,70.88 U204.28 32.88,70.88 33.88,71.88 | v28.5,70 28.88,70.38 U204.29 32.38,70.38 v36,74 | v28.5,70 28.62,69.88 U204.30 35.38,69.88 v36,70.5 | U204.31 29.12,69.38 v28.5,70 | U204.32 29.62,68.88 v28.5,70 | v36,77 35.12,77.88 U204.14 28.88,77.88 v28.5,77.5 28.62,77.38 U204.15 35.62,77.38 v36,77 | 35.38,73.38 35.88,73.88 | 34.38,72.38 34.88,72.88 | 34.88,72.88 35.38,73.38 | 33.88,71.88 34.38,72.38 | 35.88,73.88 v36,74
  Top 0.305: U201.3 88.85,90.85 89,91 89.5,91 89.76,91.26 U203.3 | U301.9 75.35,11.65 U301.EXP | U301.7 76.65,11.65 U301.EXP | U301.13 U301.EXP | U301.3 U301.EXP | U301.18 U301.EXP
  other vias: 25.5,79 25.5,77.5 25.5,76 25.5,74.5 25.5,73 25.5,71.5 25.5,70 5.5,99 7,99 8.5,99 10,99 11.5,99 13,99 14.5,99 4,97 4,95.5 4,94 4,92.5 4,91 4,89.5 4,88 4,86.5 4,85 4,83.5 4,81.5 4,80 4,78.5 4,77 4,75.5 4,74 4,72.5 4,71 4,69.5 4,68 4,66.5 4,65 4,63.5 4,62 4,60.5 4,59 4,57.5 4,56 4,54.5 4,53 4,51.5 11,50 12.5,50 14,50 12.5,46 14,46 12.5,43.5 14,43.5 15.5,43.5 17,43.5 15.5,46 17,46 18.5,46 3,43.5 4.5,43.5 6,43.5 7.5,43.5 9,43.5 10.5,43.5 1,47 1,45.5 15.5,50 17,50 18.5,50 23,50 24.5,50 26,50 27.5,50 29,50 30.5,50 23,46 24.5,46 26,46 27.5,46 29,46 30.5,46 22.47,39.53 21.41,40.59 20.35,41.65 26.47,35.53 25.41,36.59 24.35,37.65 30.47,31.53 29.41,32.59 28.35,33.65 34.47,27.53 33.41,28.59 32.35,29.65 38.47,23.53 37.41,24.59 36.35,25.65 41.41,20.59 40.35,21.65 51.9,19.85 50.4,19.85 48.9,19.85 46.5,32.5 48,32.5 49.5,32.5 46.5,34.5 48,34.5 49.5,34.5 42,38.5 42,40 42,41.5 40,40 40,41.5 30,42.5 31.5,42.5 33,42.5 30,40.5 31.5,40.5 33,40.5 39.97,50.47 38.91,49.41 37.85,48.35 42.53,52.97 43.59,51.91 38.47,53.97 37.41,52.91 47.47,55.47 46.41,54.41 45.35,53.35 48.91,58.91 47.85,57.85 37.5,58.5 39,58.5 42,58.5 43.5,58.5 30.53,57.47 31.59,56.41 28.53,56.47 29.59,55.41 50.47,54.97 49.41,53.91 48.35,52.85 56.47,57.47 55.41,56.41 54.35,55.35 59.47,55.47 58.41,54.41 57.35,53.35 60,51.5 60,50 60,48.5 60,47 60,45.5 60,44 61.5,44 61.5,45.5 61.5,47 61.5,48.5 61.5,50 61.5,51.5 61.5,53 68.47,44.47 67.41,43.41 66.35,42.35 75,37 76.5,37 78,37 75,25 76.5,25 78,25 71,21 72.5,21 74,21 75.5,21 77,21 78.5,21 80,21 84.5,21 86,21 87.5,21 89,21 90.5,21 92,21 93.5,21 85,29.5 85,31 85,32.5 85,40 86.5,40 88,40 89.5,40 91,40 92.5,40 94,40 75,17 76.5,17 78,17 67,9.5 67,8 67,6.5 67,5 67,3.5 67,2 72,6 72,7.5 75.5,5 77,5 78.5,5 85,2 86.5,2 88,2 89.5,2 91,2 92.5,2 94,2 85,9.5 85,11 85,12.5 98.5,15 98.5,13.5 98.5,12 98.5,10.5 98.5,9 98.5,7.5 98.5,6 98.5,35.5 98.5,34 98.5,32.5 98.5,31 98.5,29.5 98.5,28 98.5,26.5 99,51.5 99,50 99,48.5 99,47 99,45.5 99,44 99,42.5 92.5,71 92.5,72.5 92.5,74 92.5,75.5 92.5,77 81,70.5 82.5,70.5 84,70.5 76.5,73.5 78,73.5 79.5,73.5 76.47,78.47 75.41,77.41 74.35,76.35 79.47,81.47 78.41,80.41 77.35,79.35 81,73.5 82.5,73.5 84,73.5 76.5,70.5 78,70.5 79.5,70.5 75.97,67.47 72.91,64.41 71.85,63.35 59.13,69.07 58.41,68.41 37.5,77 42,77 43.5,77 45,77 37.5,74 39,74 40.5,74 42,74 43.5,74 45,74 48.97,81.53 47.91,82.59 46.85,83.65 48,87.5 49.5,87.5 51,87.5 52.5,87.5 54,87.5 33.1,91.81 32.04,92.87 33.83,95.69 32.75,96.8 21.47,88.03 20.41,89.09 19.35,90.15 22.5,99 24,99 25.5,99 25.5,80.5 25.5,82 25.5,83.5 25.5,65.5 25.5,67 25.5,68.5 25.5,62 25.5,63.5 37.5,70.5 39,70.5 40.5,70.5 42,70.5 43.5,70.5 45,70.5 36,67 37.5,67 39,67 40.5,67 43.5,67 45,67 39.5,63 41,63 42.5,63 44,63 45.5,63 47,63 49,98.5 50.5,98.5 52,98.5 53.5,98.5 55,98.5 56.5,98.5 58,98.5 62.5,98.5 64,98.5 65.5,98.5 67,98.5 68.5,98.5 70,98.5 74,98.5 75.5,98.5 77,98.5 78.5,98.5 76.47,86.97 75.41,85.91 74.35,84.85 55.38,65.89 80.5,90 80.5,91.5 80.5,93 84.5,89.5 84.5,91 84.5,92.5 80.5,87 80.5,88.5 82,99 83.5,99 85.5,94 87.5,99 98.5,99 99,92.5 99,88 95.5,82.5 97,82.5 98.5,82.5 93.5,84 93,90 94.5,90 95.97,89.99 94.06,92.36 90.7,91.78 90.62,93.64 85.5,88 43.97,91.03 43.26,91.75 45.47,92.53 44.41,93.59 43.35,94.65 29,95 30.86,95.05 68.97,92.47 67.91,91.41 28.8,65.15 68,65 69.5,64.5 73.74,68.8 65.68,68.14 71.5,73.5 73,73.5 67.93,78.74 54.82,78.21 55.97,78.25 57.32,78.21 58.47,78.25 61.8,78.24 39.2,89.35 40.01,88.46 37.19,87.32 37.23,86.38 38.16,86.36 76,31 76,11 73.5,25 72.35,87.35 92.5,84 88.89,85.9 90.89,87.74 40,79.5 41.5,79.5 43,79.5 64.5,70 60.12,67.04 70.5,82.5 72,82.5 70.95,87.36 59.97,88.97 58.91,87.91 57.85,86.85 56.95,73.75 57.63,70.57 56.91,69.91 58.5,76
  pour Bottom (isolate 0.203, rank 2): 0,42.5 0,100 100,100 100,0 65.5,0 65.5,14.5 61.5,18.5 42,18.5 18,42.5
  pour Top (isolate 0.203, rank 2): 0,42.5 0,100 100,100 100,0 65.5,0 65.5,14.5 61.5,18.5 42,18.5 18,42.5
I2C0-SCL-SENS  (via drill 0.3 pad 0.6)
  Top 0.203: U101.52 67.97,66.5 68.59,65.88 68.59,63.05 | R102.P$1 69.55,62 69.55,60.58 71.5,58.63 71.5,44.49 67.31,40.31 67.31,32.69 v68.99,31.02 69.36,30.65 70.71,30.65 72.5,28.86 72.5,28.05 73.91,26.64 75.55,26.64 76.65,27.74 U302.19 | U301.19 76.65,7.56 v76.33,7.24
  Top 0.305: R102.P$1 | R102.P$1 68.59,63.05
  Bottom 0.203: v76.33,7.24 76.3,7.26 74.4,7.26 68.5,13.16 68.5,29.5 68.99,29.99 v68.99,31.02
I2C0-SDA-SENS  (via drill 0.3 pad 0.6)
  Top 0.203: U101.51 67.2,62.3 68.5,61 R101.P$1 68.55,60.93 70.98,58.5 70.98,44.66 66.73,40.41 66.73,31.92 v68.13,30.52 68.56,30.09 70.48,30.09 71.95,28.61 71.95,27.76 73.62,26.09 75.75,26.09 77.3,27.64 U302.20 | v77.34,7.24 77.34,8.63 U301.20
  Bottom 0.203: v68.13,30.52 68.13,12.84 74.46,6.51 77.01,6.51 77.34,6.84 v77.34,7.24
I2C1-SCL-TTFT  (via drill 0.3 pad 0.6)
  Top 0.203: v53.07,66.53 52.6,67 U101.23 | v37,62 35.91,62 R104.P$1 35.89,62.11 35.12,62.88 U204.44
  Bottom 0.203: v53.07,66.53 47.54,61 38,61 v37,62
I2C1-SDA-TTFT  (via drill 0.3 pad 0.6)
  Top 0.203: U204.45 33.75,62.38 R103.P$1 35.12,61 v49.5,61 | U101.22 52.99,67.5 53.65,66.85 v54.46,66.85
  Bottom 0.203: v49.5,61 49.5,61.15 54.46,66.11 v54.46,66.85
MAIN_HFXTAL_N
  Top 0.203: Y101.1 62,60.59 U101.43
MAIN_HFXTAL_P
  Top 0.203: Y101.2 61.5,60.65 U101.42
MAIN_LFXTAL_N
  Top 0.203: Y102.4 48.99,66 U101.25
MAIN_LFXTAL_P
  Top 0.203: Y102.1 49,66.5 U101.24
N$1
  Top 0.254: J307.1 94.97,61.3 R326.P$1 R323.P$1
N$2
  Top 1: D302.A2 R314.2
  Top 2: D302.A2 32,4 30.5,2.5 26.5,2.5
  Top 3: 26.5,2.5 11.96,2.5 J305.P$2
  Bottom 2: D302.A2 32,4 30.5,2.5 26.5,2.5
  Bottom 3: 26.5,2.5 11.96,2.5 J305.P$2
N$4
  Top 0.203: B201.1 21.4,44.6 24.5,41.5 R214.P$1
N$5
  Top 0.203: Q303.P$1 67.05,16.55 68,17.5 68,19.55 R305.P$2
N$7
  Top 0.203: D301.C 63.94,17.66 Q303.P$3 63.1,18.5 57.5,18.5 56,20 Q304.P$2
N$13
  Top 0.203: D207.C 41.18,92.12 U205.13
N$15
  Top 0.203: D209.C 40.68,92.12 U205.14
N$16
  Top 0.203: D209.A 40,95.92 R210.P$2
N$17
  Top 0.203: B201.2 32.75,48.95 R213.P$1 35.35,49.8 Q202.P$3
N$18
  Top 0.203: Q202.P$1 34.32,56.19 R212.P$2
N$19
  Top 0.203: D207.A 41.86,95.91 R209.P$2
N$20
  Top 1: R310.1 R308.2
N$21
  Top 1: R310.2 5.27,34.23 4.46,35.04 U303.P$1
N$25
  Top 0.203: 32.18,89.71 32.18,88.03
  Top 0.254: R203.P$2 32.18,89.71 | 32.18,88.03 Q201.P$1
N$29
  Top 1: R311.2 11.5,38.77 8,38.77 7,37.77 U303.P$2
N$30
  Top 1: R311.1 12.75,34.73 10.65,32.63 R309.2
N$31
  Top 1.016: F401.P$2 49.48,27.48 46.4,24.4 ACDC401.+VO
N$34
  Top 0.203: R307.P$1 58.85,21.95 Q304.P$1
N$35
  Top 0.254: D208.A R211.P$2
N$36
  Top 0.254: R211.P$1 92.25,64.75 91.5,65.5 M201.15
N$37
  Top 1: R312.1 36.12,11.62 52.71,11.62 Q304.P$4
N$38
  Top 1: Q304.P$6 60.4,10.51 R313.1
N$39
  Top 1: R314.1 R312.2
N$40
  Top 1: 55.04,2.73 R315.1 58,3 R313.2
N$42
  Top 1: R315.2 49.77,5.46 D302.G
N$45
  Top 0.152: D401.C 63.5,38.41 64,38.41
  Top 1.016: U401.8 64,38.41 | D401.C 63.4,38.15 63.4,45.9 L401.1
N$47
  Top 0.203: U401.3 53.63,35.87 53,36.5 51.5,36.5 | 51.5,36.5 51.5,35.5 | R402.P$2 51.5,36.5
  Top 0.508: 51.5,35.5 R401.P$1
N$49
  Top 0.508: Q301.P$1 78.75,63.45 R301.P$2
N$50
  Top 0.508: J302.P$1 87.21,58.75 83.46,62.5 Q301.P$3 79.7,62.5 R302.P$1
N$51
  Top 0.203: R306.P$2 64.07,21.92 D301.A
N$52
  Top 0.508: J303.P$1 86.21,55.75 83.46,58.5 Q302.P$3 79.7,58.5 R304.P$1
N$53
  Top 0.508: Q302.P$1 78.75,59.45 R303.P$2
N$56
  Top 0.508: Q306.P$1 R319.P$2
N$57
  Top 0.508: Q306.P$3 93.31,54 J306.1
N$58
  Top 0.508: Q305.P$1 76.5,43.45 R318.P$2
N$59
  Top 0.508: J306.4 94.31,42 84,42 83.5,42.5 Q305.P$3 77.2,42.5 R321.P$1
N$60
  Top 0.508: Q308.P$1 R325.P$2
N$61
  Top 0.508: Q307.P$1 76.5,46.95 R324.P$2
N$62
  Top 0.508: J308.4 87.69,46 Q307.P$3 77.2,46 R328.P$1
N$63
  Top 0.508: Q308.P$3 88.94,50.25 J308.1
N$64  (via drill 0.3 pad 0.6)
  Top 0.254: R320.P$2 77.45,50.25 v77.5,50.25
  Bottom 0.254: v77.5,50.25 86,50.25 88.75,47.5 94.73,47.5 J306.3
N$65  (via drill 0.3 pad 0.6)
  Top 0.254: v75.5,50.25 75.45,50.25 R327.P$2
  Bottom 0.254: J308.3 89.02,46.23 85.75,49.5 76.25,49.5 v75.5,50.25
N$69  (via drill 0.3 pad 0.6)
  Top 0.203: U203.1 88.46,91.03 87.09,89.67 87.09,86.16 v87.04,86.11 | U202.5 94.23,87.25 v91.17,84.19
  Bottom 0.254: v87.04,86.11 87.32,86.11 89.25,84.19 v91.17,84.19
N$77
  Top 0.254: U203.2 89.11,92.03 89.54,92.47 93.23,92.47 93.58,92.82 U202.13
N$78
  Top 0.203: U201.4 89.18,88.2 90.3,89.32 91.94,89.32 92.26,89 92.26,88.5
  Top 0.305: U202.2 92.28,88.48 92.26,88.5
N$84  (via drill 0.3 pad 0.6)
  Top 0.203: D206.3 24,90.65 J201.D+ 24,95 v23.5,95.5 | JP202.2 37.5,84.5 v37,85
  Bottom 0.203: v37,85 36.5,85.5 36.5,91.44 31.56,96.39 24.39,96.39 v23.5,95.5
N$85  (via drill 0.3 pad 0.6)
  Top 0.203: D206.2 24.8,90.58 J201.D- 24.8,95.05 v25.25,95.5 | JP201.2 v40,84.5
  Bottom 0.203: v40,84.5 39.5,84 36.75,84 36,84.75 36,91.08 31.17,95.91 25.75,95.91 25.34,95.5 v25.25,95.5
PA0
  Top 0.203: U101.1 50.93,78.87 TP1.1
PA5  (via drill 0.3 pad 0.6)
  Top 0.203: U101.6 52.7,75.5 52.8,75.4 54.2,75.4 v54.45,75.64
  Bottom 0.203: TP2.1 55.3,74.78 v54.45,75.64
PA9
  Top 0.203: U101.28 54.5,61.89 TP3.1
PA10
  Top 0.203: U101.29 54.99,64.29 54.99,63.47 54.85,63.33 54.85,61.1 53.84,60.1 52.88,60.1 TP4.1
PA11
  Top 0.203: U101.30 55.5,63.47 55.19,63.16 55.19,60.88 53.3,58.98 51.75,58.98 TP5.1
PA12  (via drill 0.3 pad 0.6)
  Top 0.203: U101.33 57,65.04 57.54,65.58 v57.54,65.84
  Bottom 0.203: v57.54,65.84 TP6.1
PA13  (via drill 0.3 pad 0.6)
  Top 0.203: U101.34 57.49,63.6 57.24,63.34 v57.24,63.08
  Bottom 0.203: v57.24,63.08 57.24,62.62 TP7.1
PA14  (via drill 0.3 pad 0.6)
  Top 0.203: U101.35 58,63.18 v58.1,63.08
  Bottom 0.203: TP8.1 58.87,63.97 58.1,63.2 v58.1,63.08
PA15
  Top 0.203: U101.100 52.7,80.5 52.54,80.5 TP9.1
PB1
  Top 0.203: TP21.1 48.79,73.75 50.24,73.75 50.5,73.5 U101.10
PB2  (via drill 0.3 pad 0.6)
  Top 0.203: v54.46,73.09 54.37,73.09 54.28,73 U101.11
  Bottom 0.203: TP20.1 54.05,72.68 v54.46,73.09
PB4  (via drill 0.3 pad 0.6)
  Top 0.203: U101.13 v54.08,72
  Bottom 0.203: TP19.1 54.33,72.25 v54.08,72
PB9  (via drill 0.3 pad 0.6)
  Top 0.203: U101.37 v59,63.07 v58.99,63.07
  Bottom 0.203: v58.99,63.07 59.67,63.74 60.46,63.74 TP18.1
PB10  (via drill 0.3 pad 0.6)
  Top 0.203: U101.38 59.5,65.86 v59.51,65.87
  Bottom 0.203: v59.51,65.87 59.51,65.84 60.15,65.2 60.15,64.58 TP17.1
PB11  (via drill 0.3 pad 0.6)
  Top 0.203: U101.39 v60,63.06 | v60,63.06
  Bottom 0.203: v60,63.06 60,62.74 TP16.1
PB12  (via drill 0.3 pad 0.6)
  Top 0.203: U101.40 60.5,65.85 v60.48,65.87
  Bottom 0.203: v60.48,65.87 61.6,64.75 TP15.1
PC11
  Top 0.203: TP10.1 67.93,76 U101.71
PE14
  Top 0.203: U101.98 54.5,81.31 TP11.1
PE15  (via drill 0.3 pad 0.6)
  Top 0.203: U101.99 54,80.4 53.46,80.94 v53.46,80.96 | U101.99
  Bottom 0.203: TP12.1 53.53,80.89 v53.46,80.96
PF5
  Top 0.203: U101.81 63,80.48 TP14.1
PF9  (via drill 0.3 pad 0.6)
  Top 0.203: U101.87 60,78.94 v60.45,78.49
  Bottom 0.203: 60.46,78.51 v60.45,78.49 60.64,78.49 61.28,79.14 TP13.1
PRS-CH11-SSR-OUT
  Top 0.203: R305.P$1 TP301.1 67.5,30 66.01,31.49 66.01,40.38 70.5,44.87 70.5,57.37 65.5,62.37 U101.50
QSPI_CLK  (via drill 0.3 pad 0.6)
  Top 0.203: U102.6 70.05,89.86 v69.98,89.79 | U101.84 61.5,80.92 63.27,82.68 v64.55,82.68
  Bottom 0.203: v69.98,89.79 69.98,88.31 64.55,82.88 v64.55,82.68
QSPI_CS0  (via drill 0.3 pad 0.6)
  Top 0.203: U101.85 61,81.29 v61.12,81.41 | v63.5,92.5 65.08,92.5 U102.1 65.1,92.47 R105.P$1
  Bottom 0.203: v61.12,81.41 v61.12,81.42 61.75,81.42 63.5,83.16 v63.5,92.5
QSPI_D0  (via drill 0.3 pad 0.6)
  Top 0.203: U101.88 59.44,79.64 v59.44,78.44 | v68.09,88.5 71.73,88.5 U102.5
  Bottom 0.203: v59.44,78.44 59.44,78.45 68.09,87.1 v68.09,88.5
QSPI_D1
  Top 0.203: U101.89 59,80.5 60.5,82 61.5,82 67.25,87.75 67.25,90.25 66.36,91.14 U102.2
QSPI_D2
  Top 0.203: U101.90 58.5,80.63 60.37,82.5 61.37,82.5 66.63,87.76 66.63,89.37 66,90 65.86,89.86 U102.3
QSPI_D3  (via drill 0.3 pad 0.6)
  Top 0.203: U101.91 58,80.75 60.25,83 61.25,83 65,86.75 v65,87.5 | v70.1,91.19 71.78,91.19 U102.7
  Bottom 0.203: v65,87.5 68.69,91.19 v70.1,91.19
SDIO-CD  (via drill 0.3 pad 0.6)
  Top 0.203: J101.9 60.05,85.32 v60.07,85.34 60.07,87.07 61.55,88.55 R106.P$1 | v60.3,80.97 60.5,80.77 U101.86
  Bottom 0.203: v60.07,85.34 60.07,81.2 v60.3,80.97
SDIO-CLK
  Top 0.203: J101.5 55.65,83.51 55,82.86 U101.97
SDIO-CMD  (via drill 0.3 pad 0.6)
  Top 0.203: J101.3 53.45,83.08 v53.37,83 | v56.13,83.14 55.5,82.51 U101.96
  Bottom 0.203: v53.37,83 53.5,82.87 55.86,82.87 v56.13,83.14
SDIO-DAT0
  Top 0.203: J101.7 57.85,83.88 56,82.03 U101.95
SDIO-DAT1
  Top 0.203: J101.8 56.5,81.8 U101.94
SDIO-DAT2  (via drill 0.3 pad 0.6)
  Top 0.203: J101.1 51.25,83.25 v51.5,83 | v57.34,81.74 57,81.4 U101.93
  Bottom 0.203: v51.5,83 51.5,82.87 52.54,81.83 57.25,81.83 v57.34,81.74
SDIO-DAT3  (via drill 0.3 pad 0.6)
  Top 0.203: J101.2 52.35,83.14 v52.49,83 | U101.92 57.5,80.95 58.13,81.57 v58.13,82.38
  Bottom 0.203: v52.49,83 52.49,82.75 52.85,82.38 v58.13,82.38
SWCLK
  Top 0.203: J102.3 76.5,94.43 75.96,93.89 75.96,88.46 72.65,85.15 70.14,85.15 65.5,80.51 U101.76
SWDIO
  Top 0.203: U101.77 65,80.78 69.85,85.63 72.5,85.63 75.5,88.63 J102.4
SWO
  Top 0.203: J102.5 74.5,94.43 75.01,93.92 75.01,88.76 72.37,86.13 69.62,86.13 64.5,81 U101.78
TC_VIN0+  (via drill 0.3 pad 0.6)
  Top 0.203: U301.2 v79.34,10.35
  Top 0.254: v79.34,10.35
  Bottom 0.203: v79.34,10.35 80.33,11.35 80.33,14.93 J301.1-T+
TC_VIN0-
  Top 0.203: U301.4 79.16,11.65 80.32,10.48 80.32,7.08 J301.2-T-
TC_VIN1+
  Top 0.203: U302.2 79.25,30.35 80.29,31.4 80.29,34.89 J304.1-T+
TC_VIN1-  (via drill 0.3 pad 0.6)
  Top 0.203: U302.4 79.28,31.65 v79.38,31.75
  Bottom 0.203: v79.38,31.75 80.28,30.85 80.28,27.04 83.17,24.15
  Bottom 0.254: 83.17,24.15 J304.2-T-
TFT-DC  (via drill 0.3 pad 0.6)
  Top 0.203: U204.37 29.2,66.38 v29.19,66.4 | U101.26 53.5,63.5 52,62 38,62 36.41,63.59 v35.32,63.59
  Bottom 0.203: v29.19,66.4 29.19,65.61 31.79,63 34.72,63 v35.32,63.59
TFT-LEDK
  Top 0.203: R205.P$1 R204.P$1 34.45,85.53 34.9,85.98 Q201.P$3
TFT-LEDK1
  Top 0.203: U204.2 31.93,83.88 R204.P$2
TFT-LEDK2
  Top 0.203: U204.3 31.92,83.38 R205.P$2
TIM0-CC0-BUZZ
  Top 0.203: R212.P$1 47.88,56.38 54,62.5 U101.27
TIM1-CC0-TFT-BL  (via drill 0.3 pad 0.6)
  Top 0.203: R203.P$1 34.21,88.79 v34.5,88.5 | v53.51,73.64 53.36,73.64 53,74 U101.9
  Bottom 0.203: v34.5,88.5 34.5,84.5 37.98,81.02 44.11,81.02 51.48,73.64 v53.51,73.64
TIM2-CC2FAN0-SNSE  (via drill 0.3 pad 0.6)
  Top 0.203: R317.P$2 75.55,54 v75.5,54 | v65.5,76 66,75.5 U101.70
  Top 0.508: R320.P$1 R317.P$2
  Bottom 0.203: v75.5,54 69.62,54 67,56.62 67,65.63 63.5,69.13 63.5,72.5 64.5,73.5 64.5,75 v65.5,76
TIM3-CC0-FAN1-SNSE  (via drill 0.3 pad 0.6)
  Top 0.203: R322.P$2 73.05,53.05 v73,53 | v63.5,73.5 62,75 U101.7
  Top 0.508: R322.P$2 R327.P$1
  Bottom 0.203: v73,53 69.83,53 66.5,56.33 66.5,65.37 63,68.87 63,73 v63.5,73.5
TIM5-CC0-FAN0-GND  (via drill 0.3 pad 0.6)
  Top 0.203: R319.P$1 78.41,53.05 v77.49,52.13 | U101.68 v63.51,74.5 v63.5,74.51
  Bottom 0.203: v77.49,52.13 69.87,52.13 65.99,56 65.99,65.06 62.51,68.55 62.51,73.52 v63.5,74.51
TIM5-CC1-FAN0-CTRL  (via drill 0.3 pad 0.6)
  Top 0.203: R318.P$1 v73.5,43.5 | U101.69 65.04,75 64.53,75.51 v63.5,75.51
  Bottom 0.203: v63.5,75.51 61.99,74 61.99,67.14 65,64.13 65,55.5 72.84,47.66 73.84,47.66 74.5,47 74.5,44.5 v73.5,43.5
TIM6-CC0-FAN1-GND  (via drill 0.3 pad 0.6)
  Top 0.203: R325.P$1 v78.5,48 | v64.08,66 63.5,65.42 U101.46
  Bottom 0.203: v78.5,48 78.35,48.15 73.1,48.15 65.49,55.75 65.49,64.59 v64.08,66
TIM6-CC1-FAN1-CTRL  (via drill 0.3 pad 0.6)
  Top 0.203: R324.P$1 v73.5,47 | U101.47 63.98,64.28 63.98,61.18 v64,61.16
  Bottom 0.203: v73.5,47 72.75,47 64.51,55.25 64.51,60.65 v64,61.16
U0RX-USB-TX
  Top 0.203: U205.21 37.46,89.46 36.38,88.38 36.38,81.12 41.5,76 U101.5
U0TX-USB-RX  (via drill 0.3 pad 0.6)
  Top 0.203: U205.20 37.34,89.96 36,88.62 36,80.88 41.46,75.42 v50.53,75.42 | v53.5,76 53,76.5 U101.4
  Bottom 0.203: v50.53,75.42 51.11,76 v53.5,76
U1RX-BLE-TX  (via drill 0.3 pad 0.6)
  Top 0.203: U101.63 65.8,72 65.5,72.3 v65.5,72.38 | v91.5,79 M201.2
  Bottom 0.203: v65.5,72.38 65.62,72.5 85,72.5 v91.5,79
U1TX-BLE-RX  (via drill 0.3 pad 0.6)
  Top 0.203: U101.62 v64.47,71.49 | v88.5,75 M201.4
  Bottom 0.203: v64.47,71.49 65.62,71.49 66.12,71.99 85.49,71.99 v88.5,75
U4-ALRT1
  Top 0.203: TP22.1 71.56,11.06 72.8,12.3 U301.11
U7-ALRT1
  Top 0.203: U302.11 TP26.1
U11.1-C
  Top 0.203: C201.P$1 92.93,94.66 U202.14
U11.1-RC
  Top 0.203: U202.15 92.28,95.91 C201.P$2 R201.P$2
U11.2-C
  Top 0.203: C202.P$1 94.88,85.79 U202.6
U11.2-RC
  Top 0.203: U202.7 95.53,87.04 C202.P$2 R202.P$2
UART_VBUS  (via drill 0.3 pad 0.6)
  Top 0.203: v35.5,94.5 35.05,94.95 R208.P$2 36.95,97.9 R207.P$1 | v43,88.5 41.92,88.5 U205.8
  Bottom 0.203: v35.5,94.5 41.5,88.5 v43,88.5
US0-LED-MOSI
  Top 0.203: U201.2 89.53,90.17 | 89.53,89.82 89.09,89.37 88.34,89.37 87.8,88.84 87.8,85.45 86.36,84 78.87,84 68.87,74 U101.67
  Top 0.254: 89.53,90.17 89.53,89.82
US0-LED-SCK
  Top 0.203: U201.1 90.15,89.78 89.27,88.9 88.57,88.9 88.3,88.63 88.3,85.27 86.53,83.5 79,83.5 68.5,73 U101.65
  Top 0.254: U202.10 95.53,92.82 94.15,91.44 91.39,91.44 U201.1
US1-CLK-TFT  (via drill 0.3 pad 0.6)
  Top 0.203: U204.36 31.88,66.88 v32,67 | v53.54,67.99 v53.54,68 U101.21
  Bottom 0.203: v32,67 32.49,67.49 53.04,67.49 v53.54,67.99
US1-CS-TFT
  Top 0.203: U204.38 R206.P$1 | R206.P$1 35.67,69.5 U101.18
  Top 0.254: R206.P$1
US1-MISO-TFT  (via drill 0.3 pad 0.6)
  Top 0.203: U204.33 31.38,68.38 v32,69 | v53.5,69 53.5,68.94 53.06,68.5 U101.20
  Bottom 0.203: v32,69 v53.5,69
US1-MOSI-TFT  (via drill 0.3 pad 0.6)
  Top 0.203: U204.34 31.88,67.88 v32,68 | v50.25,68.42 50.84,69 U101.19
  Bottom 0.203: v32,68 32.5,68.5 50.17,68.5 v50.25,68.42
USB-D+  (via drill 0.3 pad 0.6)
  Top 0.203: U101.75 66.38,78 65.62,77.25 54.59,77.25 51.63,80.21 46.41,80.21 44.5,82.12 v44.5,82.5 | v39.5,82.5 38.75,83.25 JP202.1
  Bottom 0.203: v44.5,82.5 v39.5,82.5
USB-D-
  Top 0.203: U101.74 66.5,77.5 65.79,76.79 54.46,76.79 51.47,79.78 46.22,79.78 42.31,83.69 JP201.1
USB-ID  (via drill 0.3 pad 0.6)
  Top 0.203: U101.80 63.5,78.52 v62.98,78 | v23,94.5 23.2,94.3 J201.ID
  Bottom 0.203: v62.98,78 62.07,77.09 48.78,77.09 44.12,81.76 38.24,81.76 35.5,84.5 35.5,90.78 32.01,94.27 23.23,94.27 v23,94.5
USB-RST  (via drill 0.3 pad 0.6)
  Top 0.203: U205.9 41.92,89 42.5,89 43,89.5 v43,90 | v49.5,78.5 49.5,77.5 50,77 U101.3
  Bottom 0.203: v43,90 44.5,88.5 44.5,84.25 45.75,83 45.75,81.59 48.84,78.5 v49.5,78.5
USB-SUS  (via drill 0.3 pad 0.6)
  Top 0.203: U205.17 39.18,92.32 v39,92.5 | v50.25,77.75 50.5,77.5 U101.2
  Bottom 0.203: v39,92.5 39,91.75 41.5,89.25 43.25,89.25 44,88.5 44,84.12 45.25,82.88 45.25,81.38 48.88,77.75 v50.25,77.75
USB-UART-D+
  Top 0.203: U205.3 39.68,86.18 38.81,85.31 JP202.3
USB-UART-D-
  Top 0.203: U205.4 40.18,86.26 JP201.3
V_USB
  Top 0.203: D206.4 24.62,89.38 25.88,89.38 26.25,89.75 26.25,90.62 25.6,91.28 J201.VBUS 25.6,92.97 28.54,95.92 32.97,95.92 R207.P$2 TP202.1
VREGSW
  Top 0.203: U101.56 68.14,68.5 68.64,68 L101.2
WTIM1-CC1-ZERO-CROSS  (via drill 0.3 pad 0.6)
  Top 0.152: TP302.1 R316.P$1
  Top 0.203: 7,48.8 v7,47.5 U303.P$5 | U101.64 66.44,72.5 65.87,73.07 65.01,73.07 64.73,72.79 58.45,72.79 54.49,68.84 v54.49,68.03
  Top 0.254: R316.P$1 7,48.8
  Bottom 0.203: v54.49,68.03 53.77,67.31 53.77,66.23 35.04,47.5 v7,47.5
WTIM2-CC0-SERVO0-SIG  (via drill 0.3 pad 0.6)
  Top 0.203: R301.P$1 74.75,61.45 v74.75,57.5 | v69.49,57.06 69.02,57.06 64.5,61.58 U101.48
  Bottom 0.203: v74.75,57.5 74.31,57.06 v69.49,57.06
WTIM2-CC1-SERVO1-SIG  (via drill 0.3 pad 0.6)
  Top 0.203: R303.P$1 v75.5,59.5 | v69,58.02 68.92,58.02 65,61.95 U101.49
  Bottom 0.203: v75.5,59.5 74.02,58.02 v69,58.02

## Text on the board
tPlace: Revision: hv0a / Date: 05-19